# EAGLE design Placa controladora carro mym (EAGLE 9.3.0)
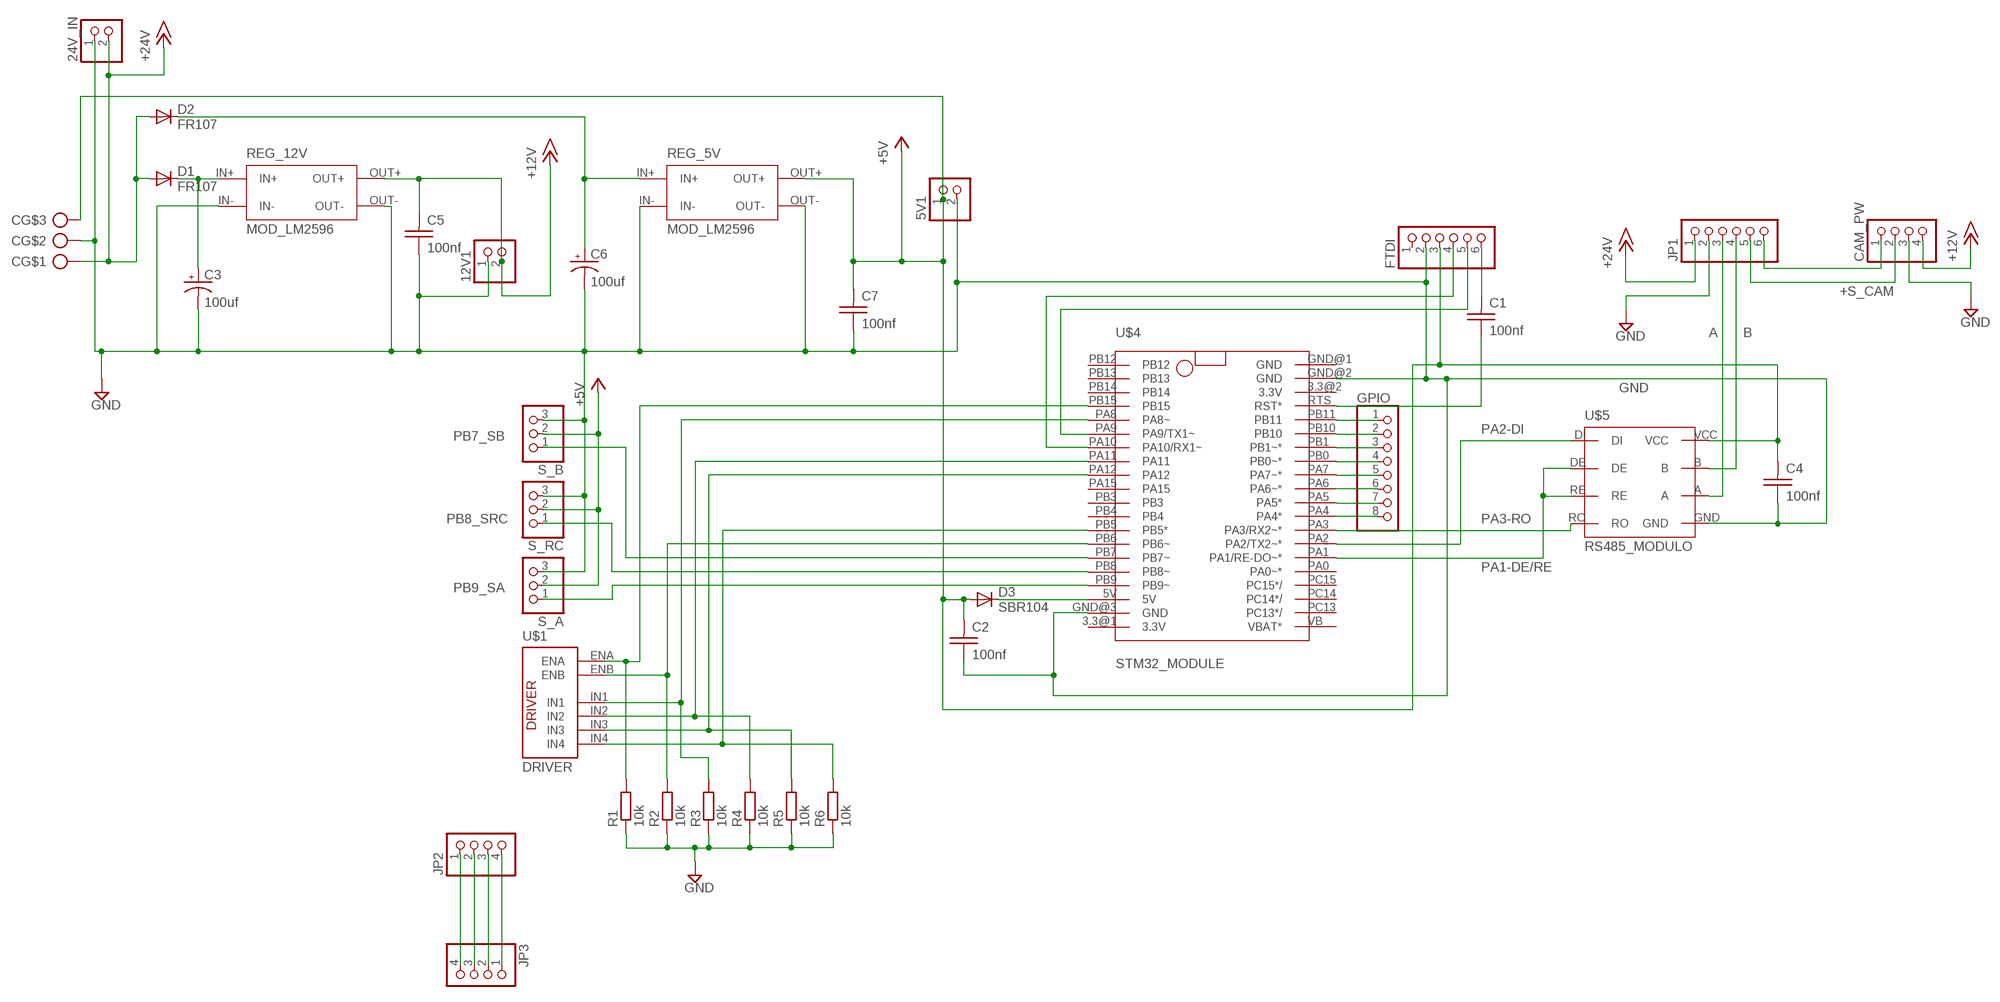
[diagram p0: schematic, sheet 1]

## Parts
5V1  PINHD-1X2  [1X02]
12V1  PINHD-1X2  [1X02]
24V_IN  PINHD-1X2  [1X02]
C  drv  CONECTOR_3_PTR500  [PTR_AK300/3]
C1  100nf  CAP_CERAMICO_TH2  [CAP_CER_2,54-5X5]
C2  100nf  CAP_CERAMICO_TH2  [CAP_CER_2,54-5X5]
C3  100uf  CAP_POLARIZADOCAP_T5-8,5  [CAP_T_5-D8,5]
C4  100nf  CAP_CERAMICO_TH2  [CAP_CER_2,54-5X5]
C5  100nf  CAP_CERAMICO_TH2  [CAP_CER_2,54-5X5]
C6  100uf  CAP_POLARIZADOCAP_T5-8,5  [CAP_T_5-D8,5]
C7  100nf  CAP_CERAMICO_TH2  [CAP_CER_2,54-5X5]
CAM_PW  PINHD-1X4  [1X04]
D1  FR107  DIODOT_2.5  [D-2.5]
D2  FR107  DIODOT_2.5  [D-2.5]
D3  SBR104  DIODOD_SMD  [D_SMD]
FTDI  PINHD-1X6  [1X06]
GPIO  PINHD-1X8  [1X08]
JP1  PINHD-1X6  [1X06]
JP2  PINHD-1X4  [1X04]
JP3  PINHD-1X4  [1X04]
R1  10k  RESISTORT_MED  [0204/7]
R2  10k  RESISTORT_MED  [0204/7]
R3  10k  RESISTORT_MED  [0204/7]
R4  10k  RESISTORT_MED  [0204/7]
R5  10k  RESISTORT_MED  [0204/7]
R6  10k  RESISTORT_MED  [0204/7]
REG_5V  MOD_LM2596  MODULO_LM2596  [MOD_LM2596_FP]
REG_12V  MOD_LM2596  MODULO_LM2596  [MOD_LM2596_FP]
S_A  PINHD-1X3  [1X03]
S_B  PINHD-1X3  [1X03]
S_RC  PINHD-1X3  [1X03]
U$1  DRIVER  [DRIVER]
U$4  STM32_MODULE  [STM32FP]
U$5  RS485_MODULO  [RS485_FP]

## Nets
+5V: 5V1.1 C2.1 C4.1 C7.1 C.3 D3.A FTDI.3 REG_5V.OUT+ S_A.2 S_B.2 S_RC.2 U$5.VCC
+12V: 12V1.2 C5.1 REG_12V.OUT+
+15V: 24V_IN.2 C.1 CAM_PW.4 D1.A D2.A JP1.1 ; supply symbol labelled +24V, +12V
+S_CAM: CAM_PW.2 JP1.5
A: JP1.3 U$5.A
B: JP1.4 U$5.B
ENA: R1.2 U$1.ENA U$4.PB15
ENEB: R2.2 U$1.ENB U$4.PB6(PB6~)
GND: 5V1.2 12V1.1 24V_IN.1 C2.2 C3.- C4.2 C5.2 C6.- C7.2 C.2 CAM_PW.3 FTDI.2 JP1.2 R1.1 R2.1 R3.1 R4.1 R5.1 R6.1 REG_5V.IN- REG_5V.OUT- REG_12V.IN- REG_12V.OUT- S_A.3 S_B.3 S_RC.3 U$4.GND@2(GND) U$4.GND@3(GND) U$5.GND
IN1: R3.2 U$1.IN1 U$4.PA8(PA8~)
IN2: R4.2 U$1.IN2 U$4.PA11
IN3: R5.2 U$1.IN3 U$4.PA12
IN4: R6.2 U$1.IN4 U$4.PB5(PB5*)
N$1: D3.K(C) U$4.5V
N$2: C6.+ D2.C REG_5V.IN+
N$3: C3.+ D1.C REG_12V.IN+
N$4: CAM_PW.1 JP1.6
N$5: JP2.1 JP3.4
N$6: FTDI.4 U$4.PA10(PA10/RX1~)
N$7: FTDI.5 U$4.PA9(PA9/TX1~)
N$8: C1.1 FTDI.6
N$9: C1.2 U$4.RTS(RST*)
N$10: JP2.2 JP3.3
N$11: JP2.3 JP3.2
N$12: JP2.4 JP3.1
N$19: GPIO.1 U$4.PB11
N$20: GPIO.2 U$4.PB10
N$21: GPIO.3 U$4.PB1(PB1~*)
N$22: GPIO.4 U$4.PB0(PB0~*)
N$23: GPIO.5 U$4.PA7(PA7~*)
N$24: GPIO.6 U$4.PA6(PA6~*)
N$25: GPIO.7 U$4.PA5(PA5*)
N$26: GPIO.8 U$4.PA4(PA4*)
PA1-DE/RE: U$4.PA1(PA1/RE-DO~*) U$5.DE U$5.RE
PA2-DI: U$4.PA2(PA2/TX2~*) U$5.DI
PA3-RO: U$4.PA3(PA3/RX2~*) U$5.RO
PB7_SB: S_B.1 U$4.PB7(PB7~)
PB8_SRC: S_RC.1 U$4.PB8(PB8~)
PB9_SA: S_A.1 U$4.PB9(PB9~)
Unconnected: FTDI.1 U$4.3.3@1(3.3V) U$4.3.3@2(3.3V) U$4.GND@1(GND) U$4.PA0(PA0~*) U$4.PA15 U$4.PB3 U$4.PB4 U$4.PB12 U$4.PB13 U$4.PB14 U$4.PC13(PC13*/) U$4.PC14(PC14*/) U$4.PC15(PC15*/) U$4.VB(VBAT*)

## Library data of the parts
5V1 12V1 24V_IN = pinhead:PINHD-1X2: PIN HEADER
C = 7DI Library:CONECTOR_3_PTR500: ptr500_con 3 space of 5.08
C1 C2 C4 C5 C7 = 7DI Library:CAP_CERAMICO: Capacitores ceramicos y de poliester, entre otros
C3 C6 = 7DI Library:CAP_POLARIZADO: Capacitor para el dac de 2.2uf
CAM_PW JP2 JP3 = pinhead:PINHD-1X4: PIN HEADER
D1-D3 = 7DI Library:DIODO: Diodo usado para protecion en las fuentes de alimentacion
FTDI JP1 = pinhead:PINHD-1X6: PIN HEADER
GPIO = pinhead:PINHD-1X8: PIN HEADER
R1-R6 = 7DI Library:RESISTOR: Resistor con varias variantes
REG_5V REG_12V = arduino_nano:MODULO_LM2596
S_A S_B S_RC = pinhead:PINHD-1X3: PIN HEADER
U$1 = arduino_nano:DRIVER
U$4 = arduino_nano:STM32_MODULE: Blue pill is the nickname given to the most popular, ultra-cheap and compact STM32F103 board. The STMicroelectronics STM32F103C8 is an ARM 32-bit Cortex-M3 Microcontroller, 72MHz, 64kB Flash, 20kB SRAM, PLL, Embedded Internal RC 8MHz and 32kHz, Real-Time Clock, Nested Interrupt Controller, Power Saving Modes, JTAG and SWD, 3 Synch. 16-bit Timers with Input Capture, Output Compare and PWM, 16-bit 6-ch Advanced Timer, 2 16-bit Watchdog Timers, SysTick Timer, 2 SPI, 2 I2C, 3 USART, USB 2.0 Full Speed Interface, CAN 2.0B Active, 2 12-bit 10-ch A/D Converter, Fast I/O Ports.
U$5 = RS485_MODULO:RS485_MODULO: RS485 MODULO by Meduag

## Board
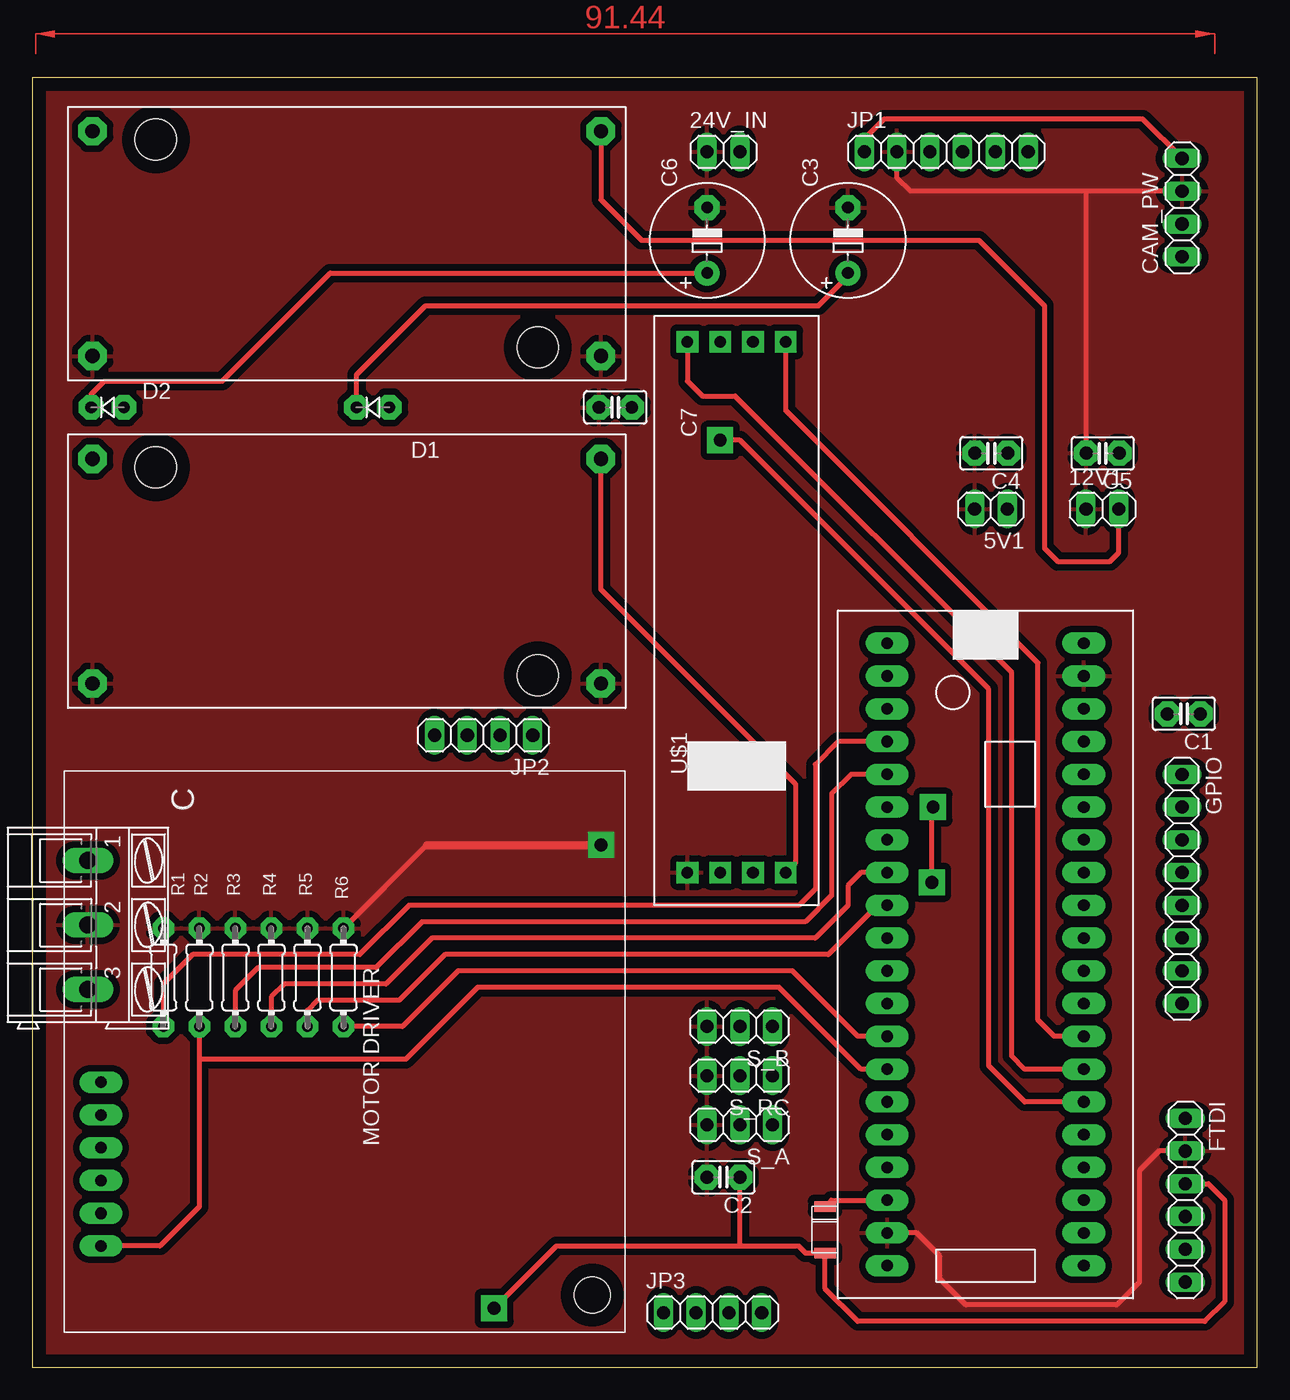
[diagram p1: board, top side]
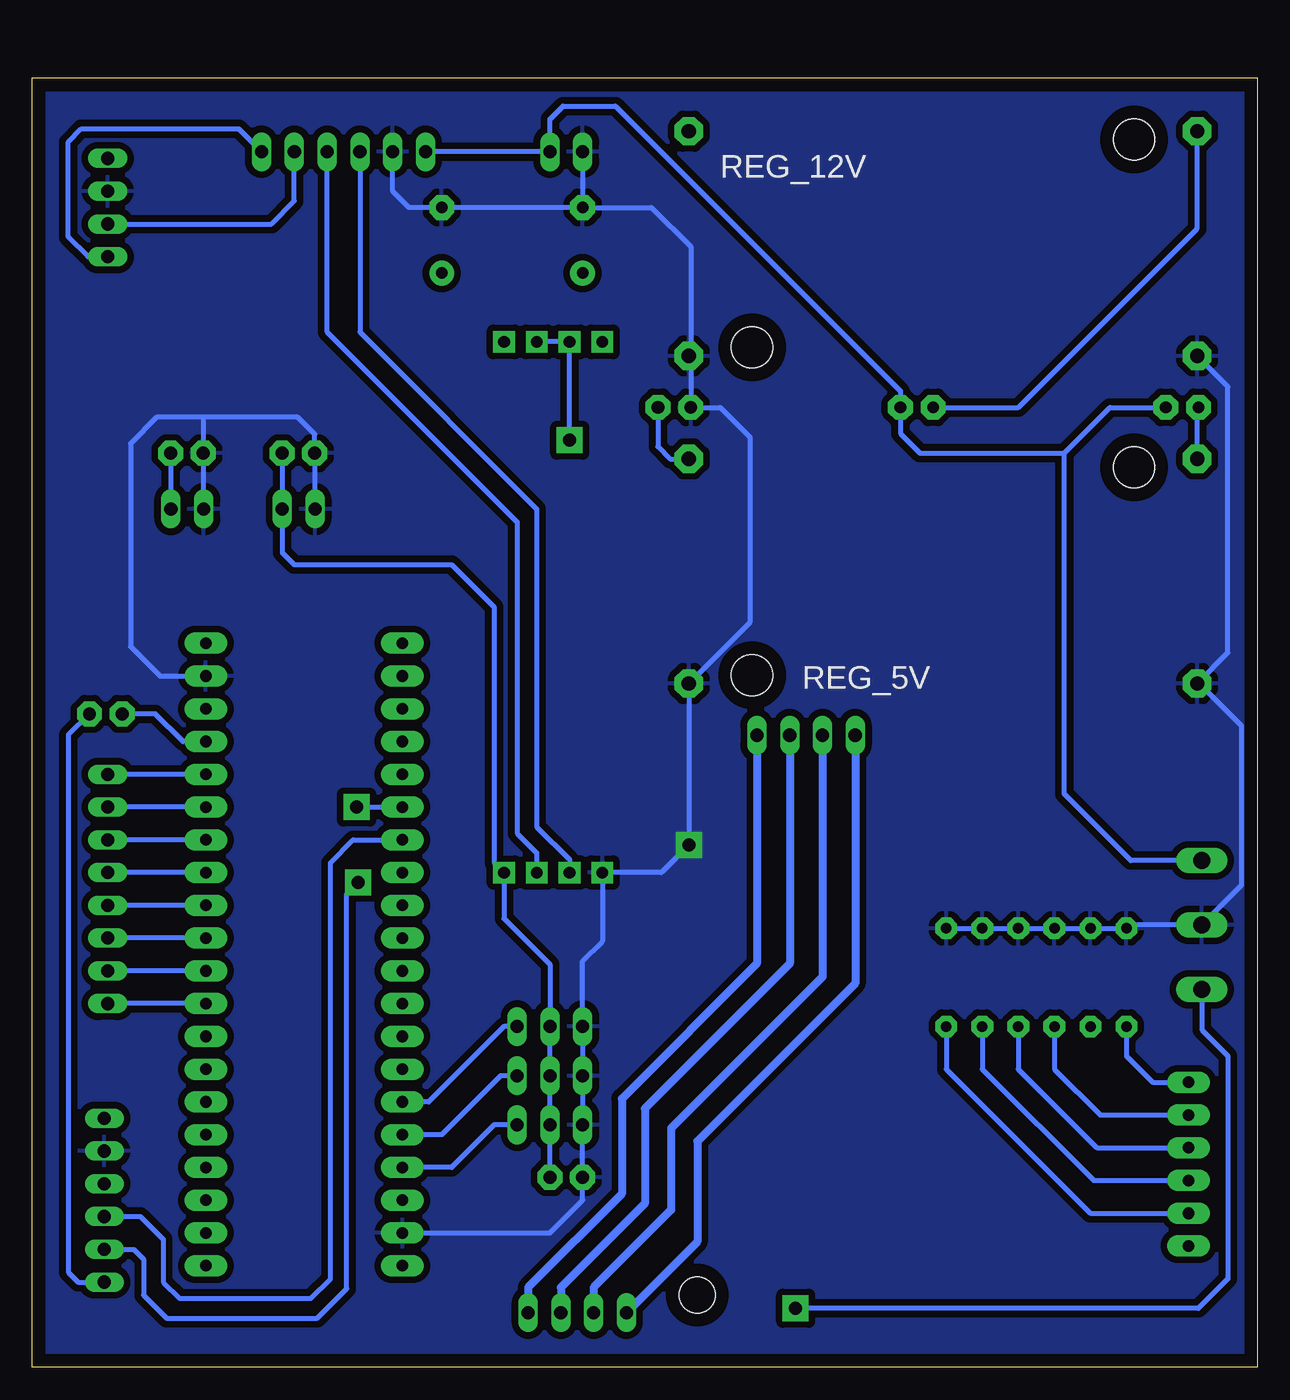
[diagram p2: board, bottom side, seen from below]

Size 95 x 100 mm. Coordinates in mm from the lower left corner, seen from the top.
Outline: 0,0 95,0 95,100 0,100 0,0
Copper layers (1*16): Top 0.035mm / dielectric 1.5mm / Bottom 0.035mm
Design rules "default *": minimum track width 6mil, minimum drill 0.35mm, track to track 20mil, track to pad 20mil, pad to pad 6mil, via to via 6mil, smd to smd 6mil, copper to edge 40mil, drill to drill 10mil, minimum pad ring 10mil, minimum via ring 20mil, stop-mask expansion 14mil, vias tented up to drill 0mil, thermal gap 20mil

### Footprints (pad centres in the part's own frame; a part is rotated, then mirrored left to right if it is on the bottom)
1X02 = drill 1.016 long: 1 -1.27,0; 2 1.27,0
PTR_AK300/3 = drill 1.321 long: 1 -5.004,0; 2 0,0; 3 5.004,0
CAP_CER_2,54-5X5 = drill 1 pad 1.93 octagon: 1 -1.27,0; 2 1.27,0
CAP_T_5-D8,5 = drill 0.9 pad 1.93: + -2.54,0 | drill 0.9 pad 1.93 octagon: - 2.54,0
1X04 = drill 1.016 long: 1 -3.81,0; 2 -1.27,0; 3 1.27,0; 4 3.81,0
D-2.5 = drill 0.9 pad 1.93 octagon: A 1.27,0; C -1.27,0
D_SMD = smd 0.813 x 1.676: A 1.8,0; K -1.8,0
1X06 = drill 1.016 long: 1 -6.35,0; 2 -3.81,0; 3 -1.27,0; 4 1.27,0; 5 3.81,0; 6 6.35,0
1X08 = drill 1.016 long: 1 -8.89,0; 2 -6.35,0; 3 -3.81,0; 4 -1.27,0; 5 1.27,0; 6 3.81,0; 7 6.35,0; 8 8.89,0
0204/7 = drill 0.813 pad 1.676 octagon: 1 -3.81,0; 2 3.81,0
MOD_LM2596_FP = drill 1.1 pad 2.2 octagon: IN+ -19.71,8.71; IN- -19.71,-8.71; OUT+ 19.71,8.71; OUT- 19.71,-8.71 | hole 3.2: -14.81,8.06; 14.81,-8.06
1X03 = drill 1.016 long: 1 -2.54,0; 2 0,0; 3 2.54,0
DRIVER = drill 0.9 pad 1.676 long: ENA 24.13,-40.64; ENB 36.83,-40.64; IN1 26.67,-40.64; IN2 29.21,-40.64; IN3 31.75,-40.64; IN4 34.29,-40.64 | hole 2.8: 40.64,-2.54
STM32FP = drill 0.9 pad 1.676 long: 3.3@1 -7.62,-24.13; 3.3@2 7.62,19.05; 5V -7.62,-19.05; GND@1 7.62,24.13; GND@2 7.62,21.59; GND@3 -7.62,-21.59; PA0 7.62,-13.97; PA1 7.62,-11.43; PA2 7.62,-8.89; PA3 7.62,-6.35; PA4 7.62,-3.81; PA5 7.62,-1.27; PA6 7.62,1.27; PA7 7.62,3.81; PA8 -7.62,13.97; PA9 -7.62,11.43; PA10 -7.62,8.89; PA11 -7.62,6.35; PA12 -7.62,3.81; PA15 -7.62,1.27; PB0 7.62,6.35; PB1 7.62,8.89; PB3 -7.62,-1.27; PB4 -7.62,-3.81; PB5 -7.62,-6.35; PB6 -7.62,-8.89; PB7 -7.62,-11.43; PB8 -7.62,-13.97; PB9 -7.62,-16.51; PB10 7.62,11.43; PB11 7.62,13.97; PB12 -7.62,24.13; PB13 -7.62,21.59; PB14 -7.62,19.05; PB15 -7.62,16.51; PC13 7.62,-21.59; PC14 7.62,-19.05; PC15 7.62,-16.51; RTS 7.62,16.51; VB 7.62,-24.13
RS485_FP = drill 0.9 pad 1.676 square: A -20.32,1.27; B -20.32,-1.27; DE 20.828,1.27; DI 20.828,3.81; GND -20.32,3.81; RE 20.828,-1.27; RO 20.828,-3.81; VCC -20.32,-3.81

### Placement (x,y rotation side)
5V1  74.34,66.55 180 top
12V1  82.98,66.55 0 top
24V_IN  53.59,94.23 0 top
C  4.32,34.29 270 top
C1  89.29,50.66 180 top
C2  53.59,14.73 180 top
C3  63.25,87.38 90 top
C4  74.37,70.87 180 top
C5  83,70.87 180 top
C6  52.32,87.38 90 top
C7  45.21,74.42 180 top
CAM_PW  89.15,89.92 90 top
D1  26.42,74.42 0 top
D2  5.84,74.42 0 top
D3  61.47,10.67 270 top
FTDI  89.41,12.95 270 top
GPIO  89.15,37.08 270 top
JP1  70.87,94.23 0 top
JP2  35,49 180 top
JP3  52.75,4.24 0 top
R1  10.16,30.23 270 top
R2  12.95,30.23 270 top
R3  15.75,30.23 270 top
R4  18.54,30.23 270 top
R5  21.34,30.23 270 top
R6  24.13,30.23 270 top
REG_5V  24.38,61.72 0 top
REG_12V  24.38,87.12 0 top
S_A  54.86,18.8 180 top
S_B  54.86,26.42 180 top
S_RC  54.86,22.61 180 top
U$1  45.97,46.23 270 top
U$4  73.91,32 0 top
U$5  54.61,58.67 90 top

### Tracks (layer width: path | path; a pad name or v marks a point on that pad's centre or on a via)
+5V  (via drill 1 pad 2)
  Top 0.406: FTDI.3 91.19,14.22 92.46,12.95 92.46,5.08 90.93,3.56 64.01,3.56 61.47,6.1 D3.A 59.94,8.87 59.41,9.4 54.86,9.4 | U$5.VCC 59.18,39.12 59.18,45.21 44.09,60.3 REG_5V.OUT+ | 54.86,9.4 C2.1 | v35.81,4.57 40.64,9.4 54.86,9.4
  Bottom 0.406: C7.1 46.48,71.37 45.54,70.43 REG_5V.OUT+ | C4.1 75.64,66.57 5V1.1 75.61,63.17 74.68,62.23 62.48,62.23 59.18,58.93 59.18,39.12 U$5.VCC 58.42,34.8 54.86,31.24 S_B.2 S_RC.2 S_A.2 C2.1 | C.3 4.32,26.16 2.29,24.13 2.29,6.86 4.57,4.57 v35.81,4.57
+12V
  Top 0.406: REG_12V.OUT+ 44.09,90.53 47.24,87.38 73.41,87.38 78.49,82.3 78.49,63.5 79.5,62.48 83.57,62.48 84.25,63.17 12V1.2
  Bottom 0.406: C5.1 84.27,66.57 12V1.2
+15V
  Top 0.406: CAM_PW.4 86.11,96.77 66.04,96.77 64.52,95.25 JP1.1
  Bottom 0.406: JP1.1 24V_IN.2 54.86,96.77 53.85,97.79 49.78,97.79 27.69,75.69 D1.A 27.69,72.39 26.16,70.87 14.99,70.87 | 14.99,70.87 11.43,74.42 D2.A | C.1 9.83,39.29 14.99,44.45 14.99,70.87
+S_CAM
  Bottom 0.406: CAM_PW.2 76.45,88.65 74.68,90.42 JP1.5
A
  Bottom 0.406: JP1.3 69.6,80.26 55.88,66.55 55.88,41.91 53.34,39.37 U$5.A
B
  Bottom 0.406: U$5.B 55.88,39.88 57.4,41.4 57.4,65.53 72.14,80.26 JP1.4
ENA
  Top 0.406: U$4.PB15 62.48,48.51 60.71,46.74 60.71,37.08 59.44,35.81 29.21,35.81 25.4,32 12.45,32 10.16,29.72 R1.2
  Bottom 0.406: U$1.ENA 8.13,22.1 10.16,24.13 R1.2
ENEB
  Top 0.406: 12.95,23.88 12.95,12.45 9.91,9.4 U$1.ENB | 12.95,23.88 28.96,23.88 34.54,29.46 57.91,29.46 64.26,23.11 U$4.PB6 | R2.2 12.95,23.88
GND  (via drill 1 pad 2)
  Top 0.406: FTDI.2 87.38,16.76 85.85,15.24 85.85,6.6 84.07,4.83 72.39,4.83 70.36,6.86 70.36,8.64 68.58,10.41 U$4.GND@3 | CAM_PW.3 81.79,91.19 | 81.79,91.19 68.07,91.19 67.06,92.2 JP1.2 | C5.2 81.73,91.13 81.79,91.19 | R6.1 30.58,40.49
  Top 0.61: 30.58,40.49 v44.09,40.49
  Bottom 0.406: U$4.GND@3 54.86,10.41 52.32,12.95 C2.2 S_A.3 S_RC.3 S_B.3 52.32,31.5 50.8,33.02 U$5.GND 46.23,38.35 v44.09,40.49 REG_5V.OUT- 39.37,57.74 39.37,72.14 41.66,74.42 C7.2 43.94,78.26 | 24V_IN.1 C6.- | C6.- C3.- 65.79,89.92 67.06,91.19 JP1.2 | REG_5V.IN- 4.59,53.1 | 4.59,53.1 2.29,55.4 2.29,76.02 REG_12V.IN- | REG_12V.OUT- 43.94,78.26 | 5V1.2 73.1,66.57 C4.2 73.1,72.33 74.42,73.66 81.73,73.66 | 12V1.1 81.73,66.57 C5.2 81.73,73.66 | 81.73,73.66 85.34,73.66 87.38,71.63 87.38,55.88 85.09,53.59 U$4.GND@2 | C6.- 46.99,89.92 43.94,86.87 43.94,78.26 | 24.38,34.04 R6.1 R5.1 R4.1 R3.1 R2.1 R1.1 9.59,34.29 C.2 1.22,37.39 1.22,49.73 4.59,53.1
  pour Bottom (isolate 0.254): 1,99 94,99 94,2 94,1 1,1
  pour Top (isolate 0.254): 1,99 94,99 94,1 1,1
IN1
  Top 0.406: U$4.PA8 63.5,45.97 61.98,44.45 61.98,36.58 59.94,34.54 30.23,34.54 26.67,30.99 17.53,30.99 15.75,29.21 R3.2
  Bottom 0.406: U$1.IN1 12.19,19.56 15.75,23.11 R3.2
IN2
  Top 0.406: U$4.PA11 64.26,38.35 63.25,37.34 63.25,35.81 60.71,33.27 30.99,33.27 27.43,29.72 19.56,29.72 18.54,28.7 R4.2
  Bottom 0.406: U$1.IN2 12.45,17.02 18.54,23.11 R4.2
IN3
  Top 0.406: U$4.PA12 65.53,35.81 61.72,32 32,32 28.45,28.45 22.1,28.45 21.34,27.69 R5.2
  Bottom 0.406: U$1.IN3 12.7,14.48 21.34,23.11 R5.2
IN4
  Top 0.406: U$4.PB5 64.01,25.65 58.93,30.73 33.02,30.73 28.7,26.42 R6.2
  Bottom 0.406: R6.2 24.13,23.11 12.95,11.94 U$1.IN4
N$1
  Top 0.406: D3.K 61.95,12.95 U$4.5V
N$2
  Top 0.406: D2.C 4.57,75.44 5.59,76.45 14.73,76.45 23.11,84.84 C6.+
  Bottom 0.406: REG_5V.IN+ 4.67,74.32 D2.C
N$3
  Top 0.406: D1.C 25.15,76.96 30.48,82.3 60.96,82.3 63.25,84.58 C3.+
  Bottom 0.406: D1.C 18.54,74.42 4.67,88.29 REG_12V.IN+
N$4
  Bottom 0.406: CAM_PW.1 90.68,86.11 92.2,87.63 92.2,95 91.19,96.01 78.99,96.01 JP1.6
N$5
  Bottom 0.61: JP2.1 38.81,31.29 49.28,20.83 49.28,13.46 56.56,6.18 JP3.4
N$6
  Bottom 0.406: FTDI.4 86.61,11.68 84.84,9.91 84.84,6.6 83.57,5.33 73.41,5.33 71.88,6.86 71.88,39.12 70.1,40.89 U$4.PA10
N$7  (via drill 1 pad 2)
  Top 0.406: v69.75,37.59 69.75,43.33 v69.85,43.43
  Bottom 0.406: FTDI.5 87.12,9.14 86.36,8.38 86.36,5.59 84.58,3.81 72.9,3.81 70.61,6.1 70.61,36.73 v69.75,37.59 | v69.85,43.43 U$4.PA9
N$8
  Bottom 0.406: C1.1 92.2,49.02 92.2,7.37 91.44,6.6 FTDI.6
N$9
  Bottom 0.406: U$4.RTS 83.31,48.51 85.46,50.66 C1.2
N$10
  Bottom 0.61: JP2.2 36.27,31.29 47.5,20.07 47.5,12.7 54.02,6.18 JP3.3
N$11
  Bottom 0.61: JP2.3 33.73,30.28 45.47,18.54 45.47,12.19 51.48,6.18 JP3.2
N$12
  Bottom 0.61: JP2.4 31.19,29.77 43.43,17.53 43.43,9.74 JP3.1
N$19
  Bottom 0.406: U$4.PB11 GPIO.1
N$20
  Bottom 0.406: U$4.PB10 GPIO.2
N$21
  Bottom 0.406: U$4.PB1 GPIO.3
N$22
  Bottom 0.406: U$4.PB0 GPIO.4
N$23
  Bottom 0.406: U$4.PA7 GPIO.5
N$24
  Bottom 0.406: U$4.PA6 GPIO.6
N$25
  Bottom 0.406: U$4.PA5 GPIO.7
N$26
  Bottom 0.406: U$4.PA4 GPIO.8
PA1-DE/RE  (via drill 1 pad 2)
  Top 0.406: U$4.PA1 76.96,20.57 74.17,23.37 74.17,52.58 54.86,71.88 v53.34,71.88
  Bottom 0.406: v53.34,71.88 U$5.DE U$5.RE
PA2-DI
  Top 0.406: U$4.PA2 76.96,23.11 75.95,24.13 75.95,53.85 54.5,75.3 51.96,75.3 50.8,76.45 U$5.DI
PA3-RO
  Top 0.406: U$4.PA3 79.25,25.65 77.98,26.92 77.98,54.61 58.42,74.17 U$5.RO
PB7_SB
  Bottom 0.406: S_B.1 58.42,26.42 64.26,20.57 U$4.PB7
PB8_SRC
  Bottom 0.406: S_RC.1 58.67,22.61 63.25,18.03 U$4.PB8
PB9_SA
  Bottom 0.406: S_A.1 59.18,18.8 62.48,15.49 U$4.PB9
(copper drawn outside any net)
  shapes: Top area x2